# EAGLE schematic 1284schema (EAGLE 7.5.0)
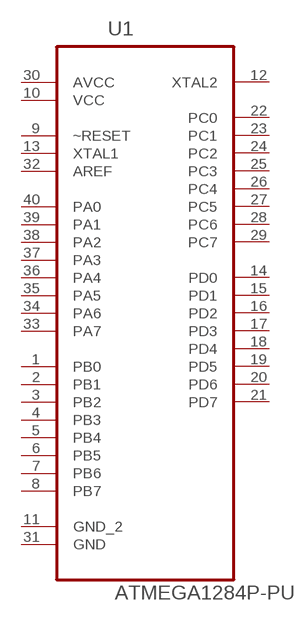
[diagram p0: schematic, sheet 1]

## Parts
U1  ATMEGA1284P-PU  [DIP254P1524X483-40]
Unconnected: U1.1(PB0) U1.2(PB1) U1.3(PB2) U1.4(PB3) U1.5(PB4) U1.6(PB5) U1.7(PB6) U1.8(PB7) U1.9(~RESET) U1.11(GND_2) U1.12(XTAL2) U1.13(XTAL1) U1.14(PD0) U1.15(PD1) U1.16(PD2) U1.17(PD3) U1.18(PD4) U1.19(PD5) U1.20(PD6) U1.21(PD7) U1.22(PC0) U1.23(PC1) U1.24(PC2) U1.25(PC3) U1.26(PC4) U1.27(PC5) U1.28(PC6) U1.29(PC7) U1.31(GND) U1.32(AREF) U1.33(PA7) U1.34(PA6) U1.35(PA5) U1.36(PA4) U1.37(PA3) U1.38(PA2) U1.39(PA1) U1.40(PA0)

## Power pins joined to a net without a drawn wire
AVCC: U1.30(AVCC)
VCC: U1.10(VCC)

## Library data of the parts
U1 = Atmel_By_element14_Batch_1-00:ATMEGA1284P-PU: 8-bit Microcontroller with In-System Programmable Flash; MPN: ATMEGA1284P-PU; OC_FARNELL: 1715481; OC_NEWARK: 15R0264; PACKAGE: PDIP-40; SUPPLIER: Atmel